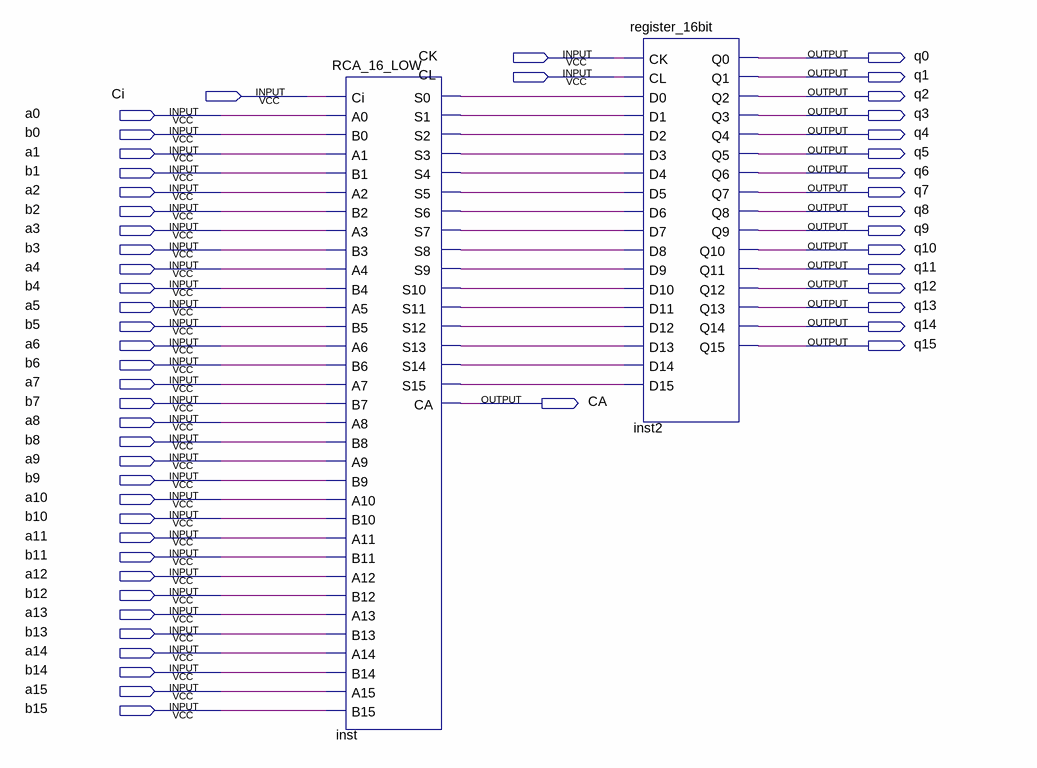
[diagram p0: schematic sheet]
// Quartus schematic test_register_time.bdf as structural Verilog: 2 symbols, 52 pins
module test_register_time (
  input  CK,
  input  CL,
  input  Ci,
  input  a0,
  input  b0,
  input  a1,
  input  b1,
  input  a2,
  input  b2,
  input  a3,
  input  b3,
  input  a4,
  input  b4,
  input  a5,
  input  b5,
  input  a6,
  input  b6,
  input  a7,
  input  b7,
  input  a8,
  input  b8,
  input  a9,
  input  b9,
  input  a10,
  input  b10,
  input  a11,
  input  b11,
  input  a12,
  input  b12,
  input  a13,
  input  b13,
  input  a14,
  input  b14,
  input  a15,
  input  b15,
  output q0,
  output q1,
  output q2,
  output q3,
  output q4,
  output q5,
  output q6,
  output q7,
  output q8,
  output q9,
  output q10,
  output q11,
  output q12,
  output q13,
  output q14,
  output q15,
  output CA
);

  wire inst_s0, inst_s1, inst_s2, inst_s3, inst_s4, inst_s5, inst_s6, inst_s7, inst_s8, inst_s9, inst_s10,
       inst_s11, inst_s12, inst_s13, inst_s14, inst_s15;

  RCA_16_LOW inst (
    .Ci(Ci), .A0(a0), .B0(b0), .A1(a1), .B1(b1), .A2(a2), .B2(b2), .A3(a3), .B3(b3), .A4(a4), .B4(b4),
    .A5(a5), .B5(b5), .A6(a6), .B6(b6), .A7(a7), .B7(b7), .A8(a8), .B8(b8), .A9(a9), .B9(b9), .A10(a10),
    .B10(b10), .A11(a11), .B11(b11), .A12(a12), .B12(b12), .A13(a13), .B13(b13), .A14(a14), .B14(b14),
    .A15(a15), .B15(b15), .S0(inst_s0), .S1(inst_s1), .S2(inst_s2), .S3(inst_s3), .S4(inst_s4), .S5(inst_s5),
    .S6(inst_s6), .S7(inst_s7), .S8(inst_s8), .S9(inst_s9), .S10(inst_s10), .S11(inst_s11), .S12(inst_s12),
    .S13(inst_s13), .S14(inst_s14), .S15(inst_s15), .CA(CA));
  register_16bit inst2 (
    .CK(CK), .CL(CL), .D0(inst_s0), .D1(inst_s1), .D2(inst_s2), .D3(inst_s3), .D4(inst_s4), .D5(inst_s5),
    .D6(inst_s6), .D7(inst_s7), .D8(inst_s8), .D9(inst_s9), .D10(inst_s10), .D11(inst_s11), .D12(inst_s12),
    .D13(inst_s13), .D14(inst_s14), .D15(inst_s15), .Q0(q0), .Q1(q1), .Q2(q2), .Q3(q3), .Q4(q4), .Q5(q5),
    .Q6(q6), .Q7(q7), .Q8(q8), .Q9(q9), .Q10(q10), .Q11(q11), .Q12(q12), .Q13(q13), .Q14(q14), .Q15(q15));
endmodule
